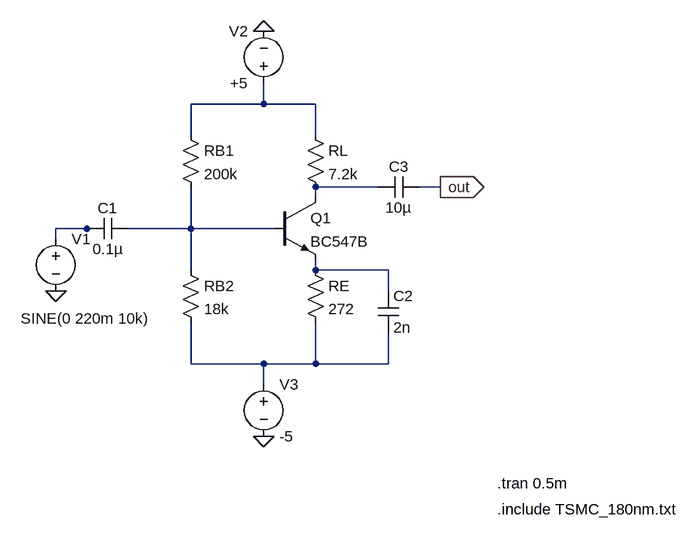
[diagram p0: schematic ce.asc]
ce.asc, the LTspice schematic file:
Version 4
SHEET 1 2180 708
WIRE 272 -48 272 -80
WIRE 272 -48 160 -48
WIRE 352 -48 272 -48
WIRE 160 0 160 -48
WIRE 352 0 352 -48
WIRE 448 80 352 80
WIRE 544 80 512 80
WIRE 352 96 352 80
WIRE 0 144 -48 144
WIRE 16 144 0 144
WIRE 160 144 160 80
WIRE 160 144 64 144
WIRE 288 144 160 144
WIRE -48 160 -48 144
WIRE 160 208 160 144
WIRE 352 208 352 192
WIRE 464 208 352 208
WIRE 464 240 464 208
WIRE 160 352 160 288
WIRE 272 352 160 352
WIRE 352 352 352 288
WIRE 352 352 272 352
WIRE 464 352 464 304
WIRE 464 352 352 352
WIRE 272 384 272 352
FLAG 544 80 out
IOPIN 544 80 Out
FLAG 272 -160 0
FLAG 272 464 0
FLAG -48 240 0
SYMBOL res 144 -16 R0
SYMATTR InstName RB1
SYMATTR Value 200k
SYMBOL res 144 192 R0
SYMATTR InstName RB2
SYMATTR Value 18k
SYMBOL npn 288 96 R0
SYMATTR InstName Q1
SYMATTR Value BC547B
SYMBOL res 336 -16 R0
SYMATTR InstName RL
SYMATTR Value 7.2k
SYMBOL res 336 192 R0
SYMATTR InstName RE
SYMATTR Value 272
SYMBOL cap 448 240 R0
SYMATTR InstName C2
SYMATTR Value 2n
SYMBOL cap 64 128 R90
WINDOW 0 0 32 VBottom 2
WINDOW 3 32 32 VTop 2
SYMATTR InstName C1
SYMATTR Value 0.1µ
SYMBOL voltage 272 -64 R180
WINDOW 0 24 96 Left 2
WINDOW 3 24 16 Left 2
SYMATTR InstName V2
SYMATTR Value +5
SYMBOL voltage 272 368 R0
SYMATTR InstName V3
SYMATTR Value -5
SYMBOL cap 512 64 R90
WINDOW 0 0 32 VBottom 2
WINDOW 3 32 32 VTop 2
SYMATTR InstName C3
SYMATTR Value 10µ
SYMBOL voltage -48 144 R0
WINDOW 123 0 0 Left 0
WINDOW 39 0 0 Left 0
WINDOW 3 -54 138 Left 2
SYMATTR Value SINE(0 220m 10k)
SYMATTR InstName V1
TEXT 632 536 Left 2 !.tran 0.5m
TEXT 632 576 Left 2 !.include TSMC_180nm.txt

The netlist it stands for:
* ce.asc
RB1 N001 N004 200k
RB2 N004 N006 18k
Q1 N002 N004 N005 0 BC547B
RL N001 N002 7.2k
RE N005 N006 272
C2 N005 N006 2n
C1 N004 N003 0.1µ
V2 N001 0 +5
V3 N006 0 -5
C3 out N002 10µ
V1 N003 0 SINE(0 220m 10k)
.model NPN NPN
.model PNP PNP
.lib standard.bjt
.tran 0.5m
.include TSMC_180nm.txt
.backanno
.end